# Altium schematic sheet bunny_brain_D.SchDoc
size D; Organization: Altium Limited; Address1: 3 Minna Close; Address2: Belrose; Address3: NSW 2085; Address4: Australia; SheetNumber: 3; SheetTotal: 3; PAGE_TITLE: -
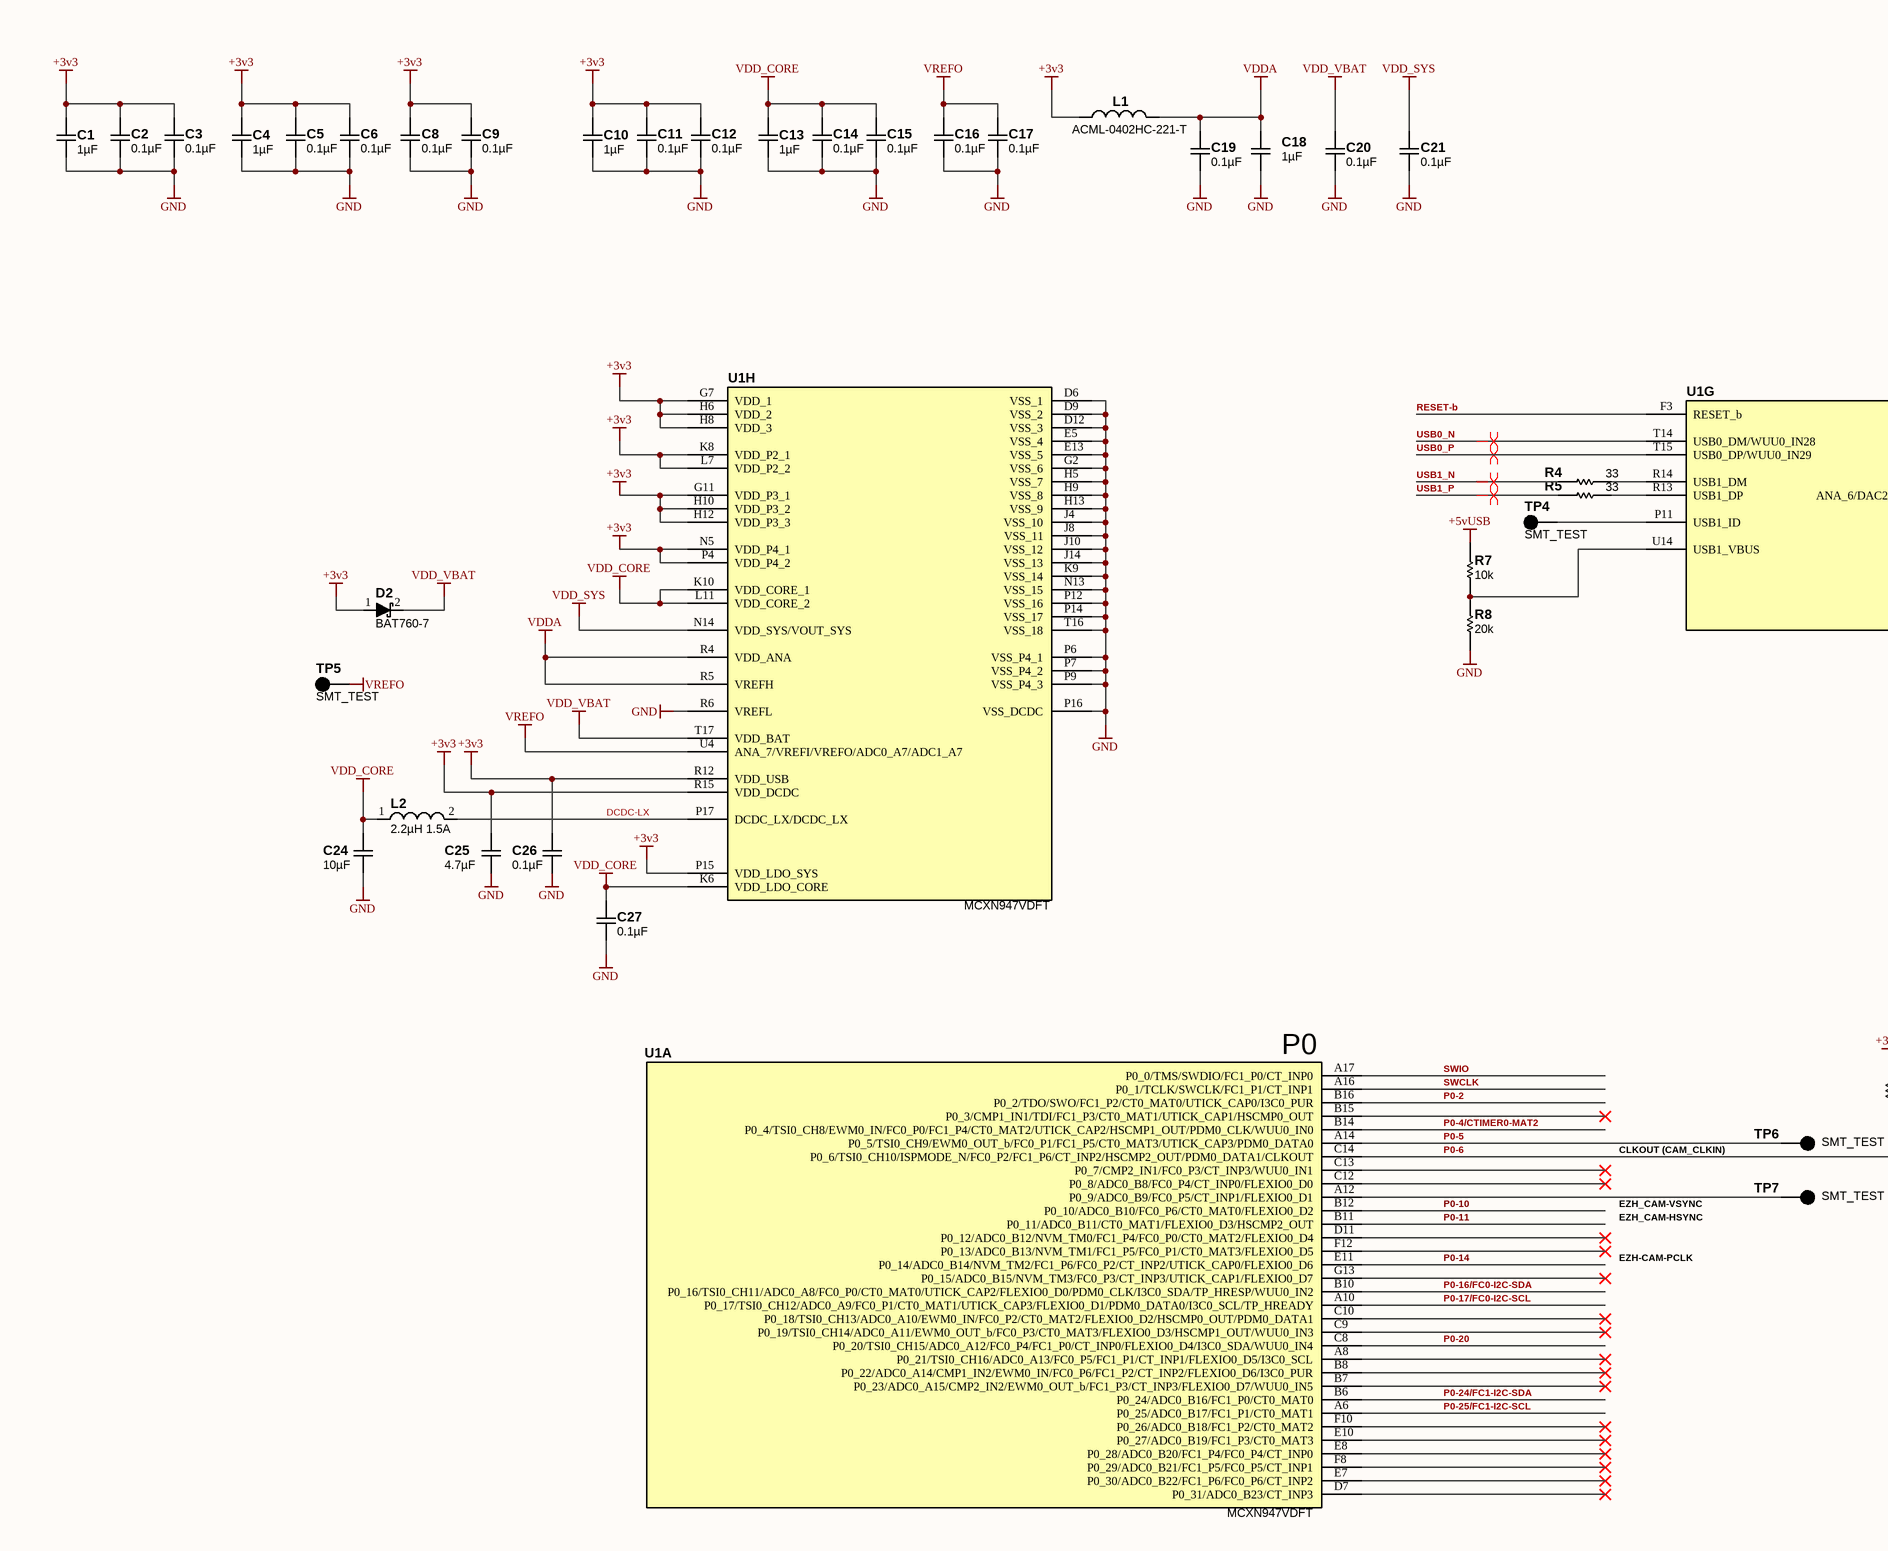
[diagram p0: bunny_brain_D.SchDoc, top left]
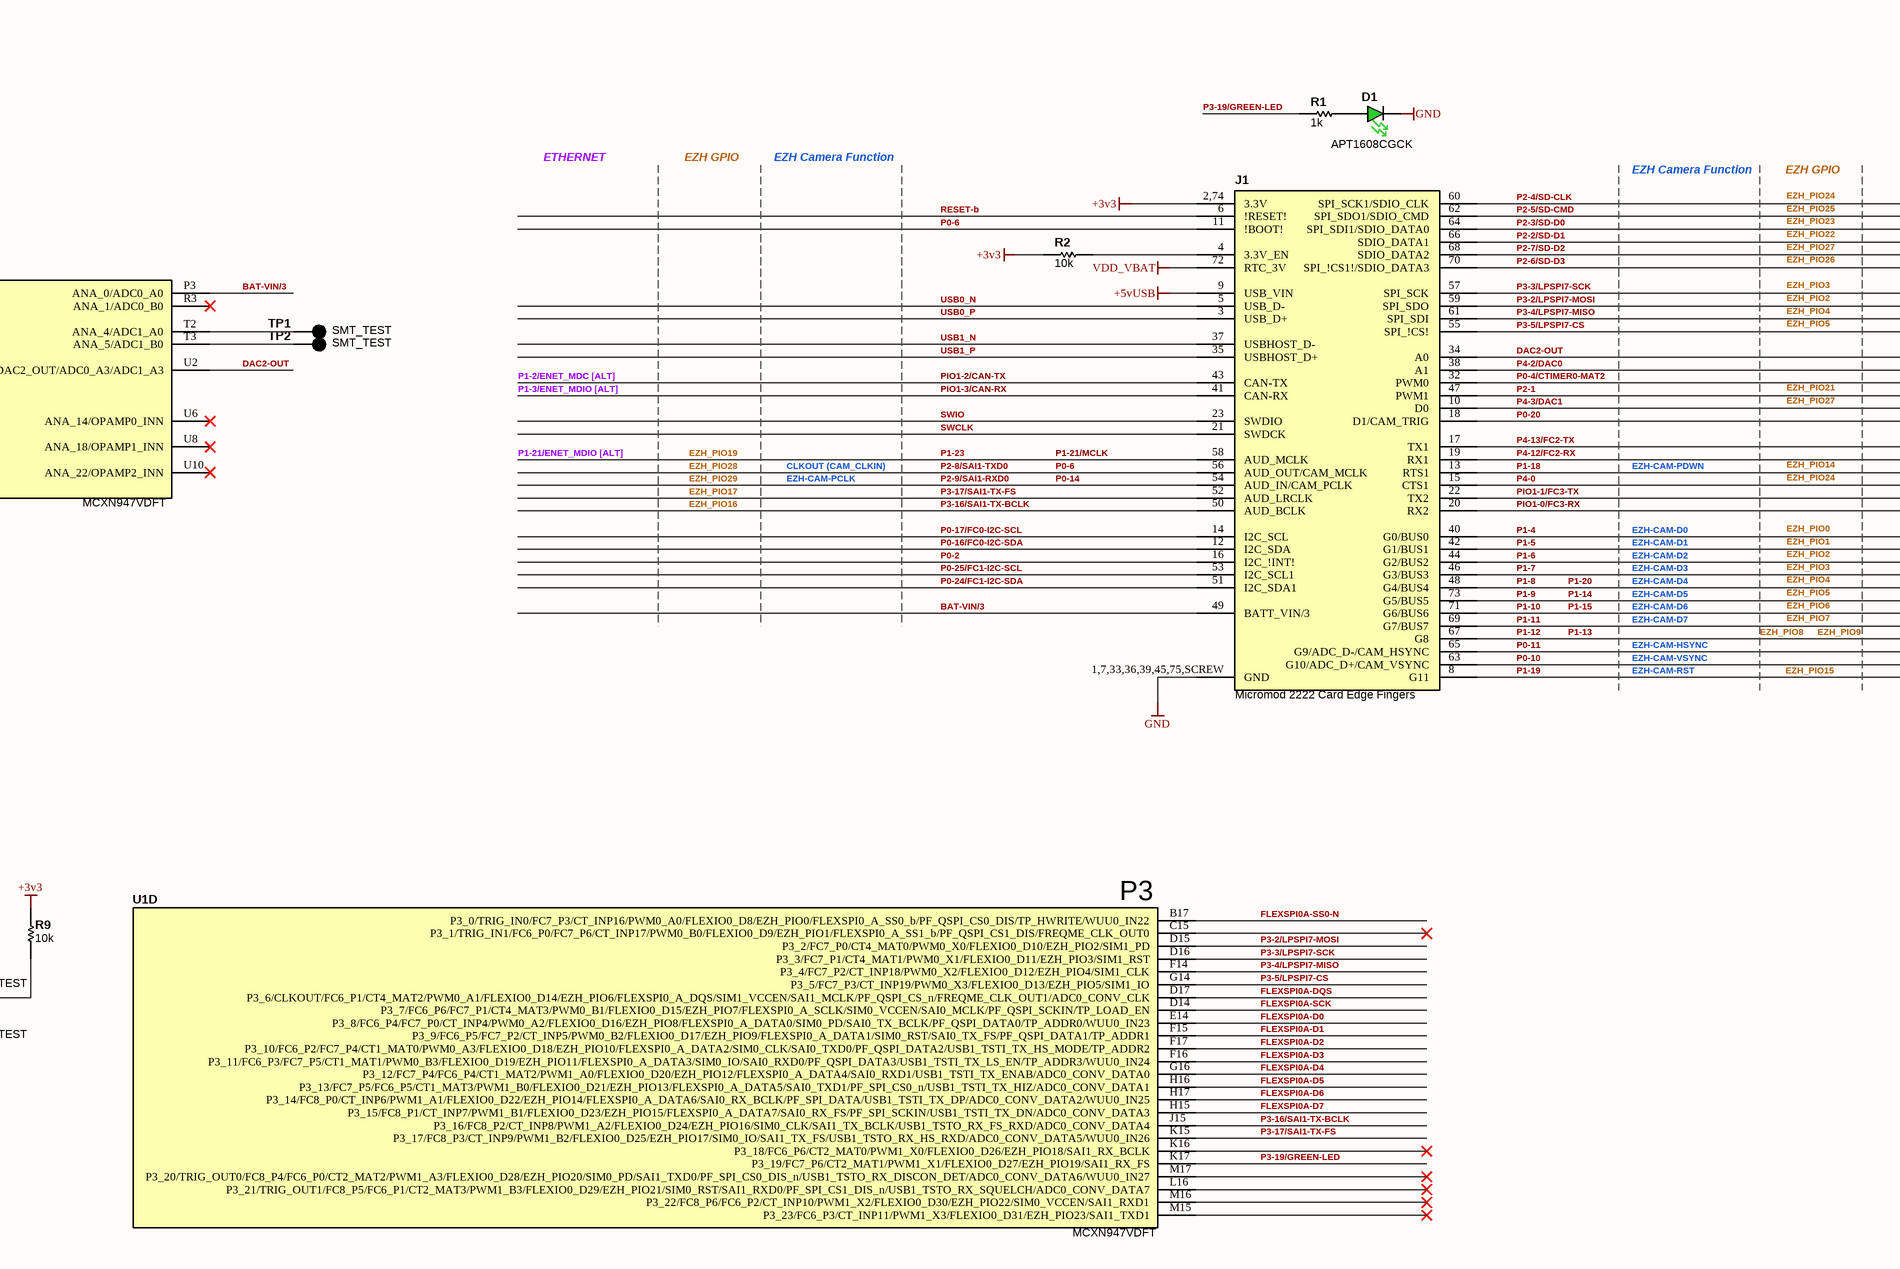
[diagram p1: bunny_brain_D.SchDoc, top middle]
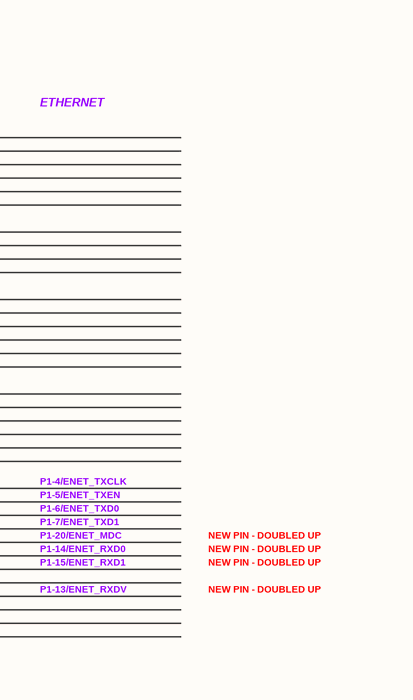
[diagram p2: bunny_brain_D.SchDoc, top right]
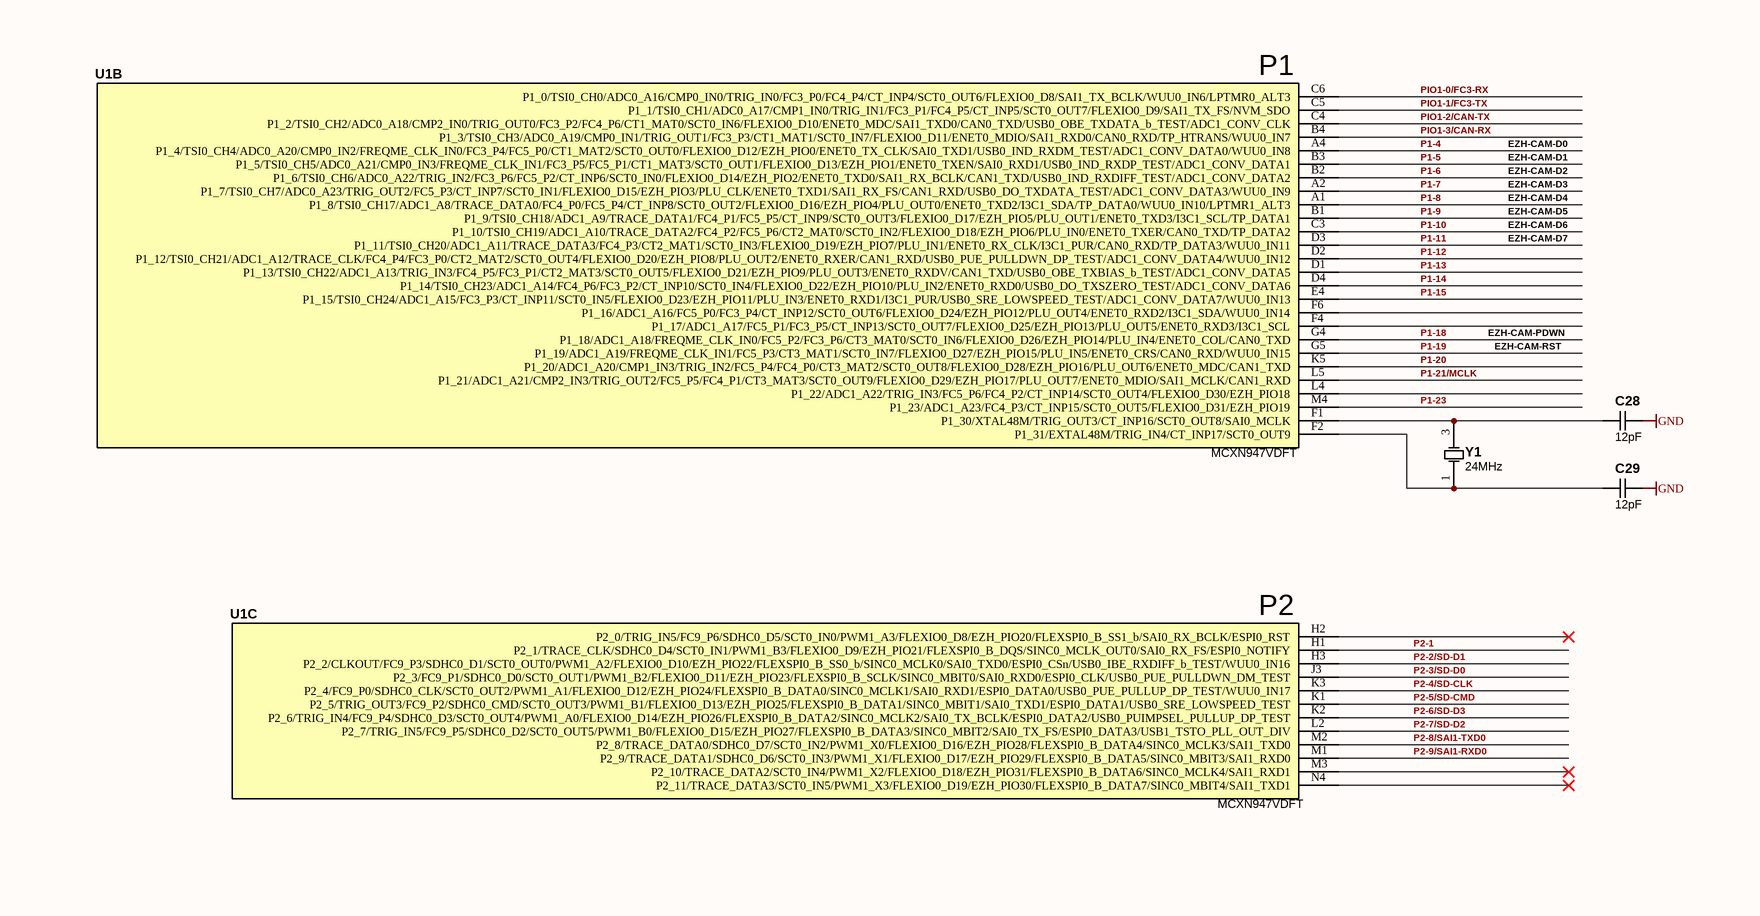
[diagram p3: bunny_brain_D.SchDoc, bottom left]
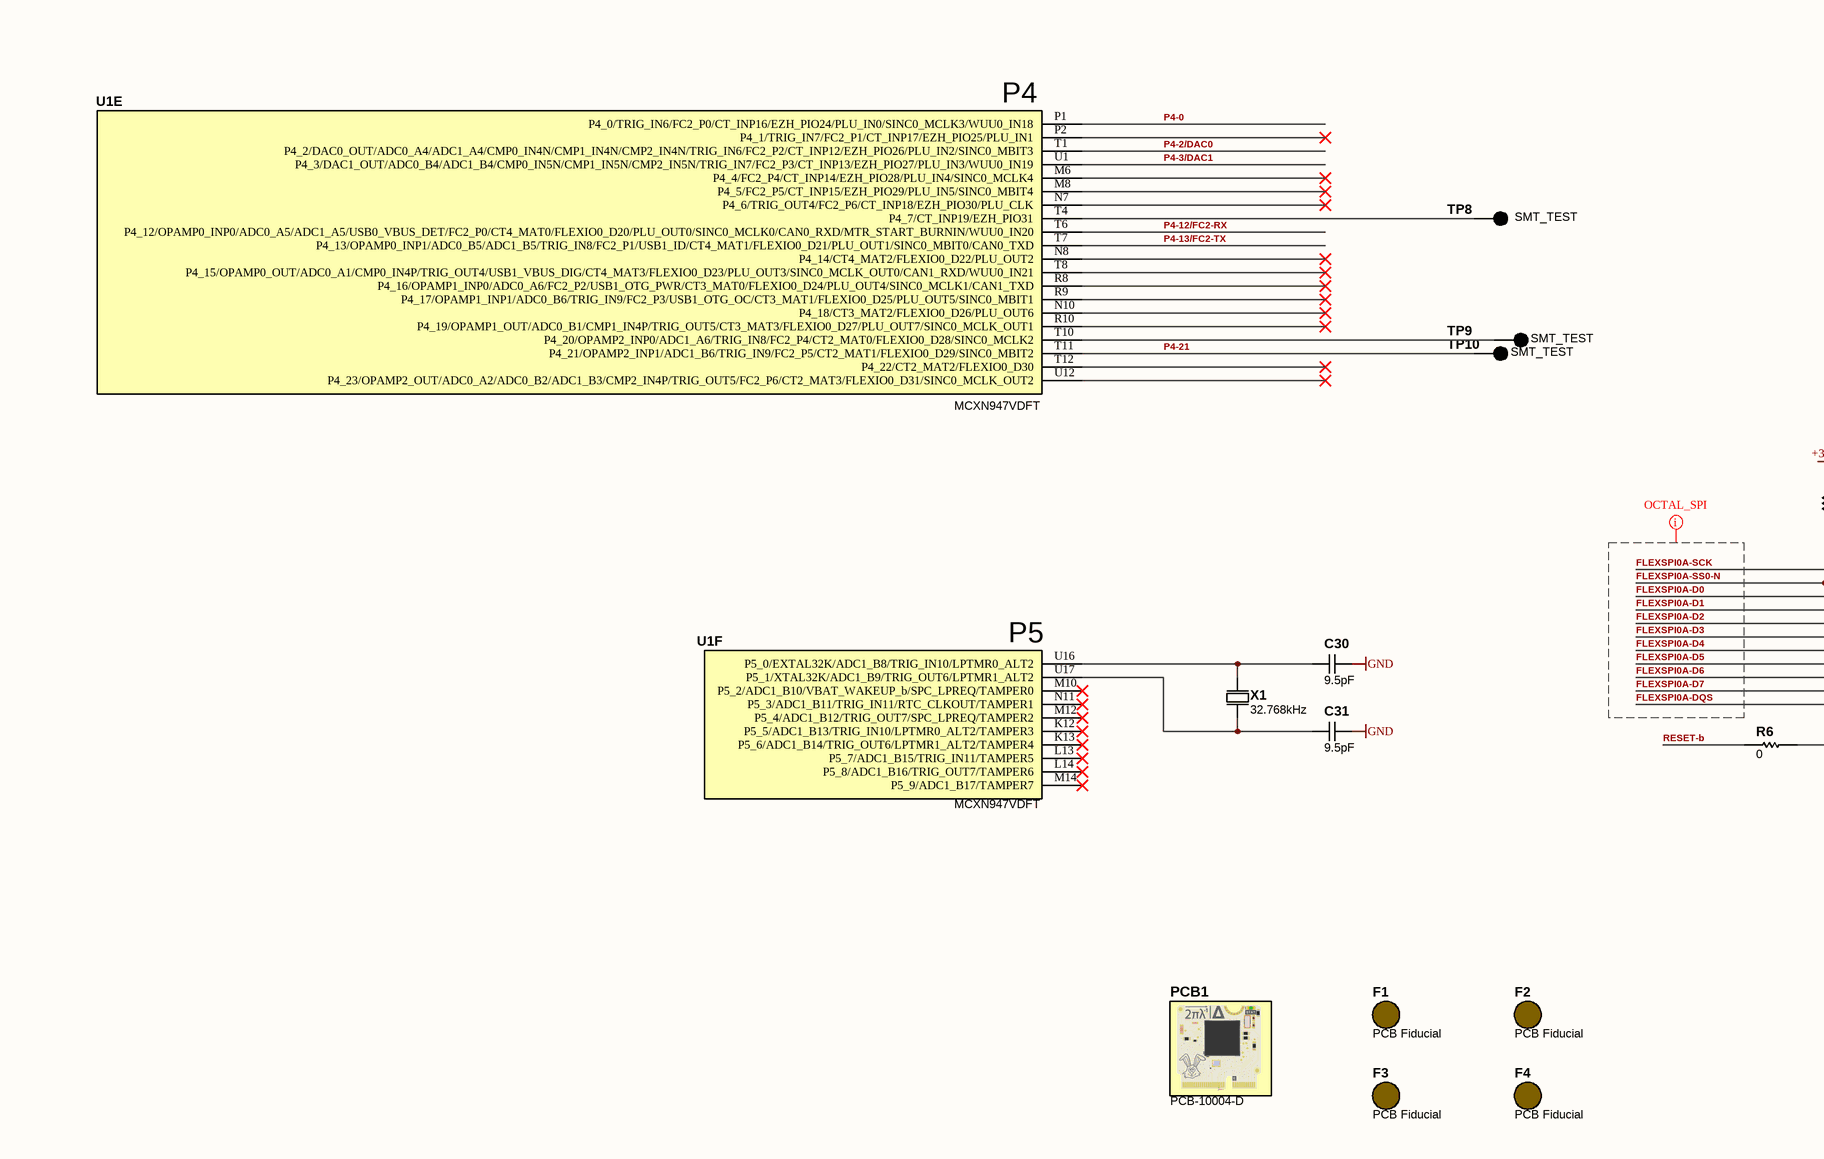
[diagram p4: bunny_brain_D.SchDoc, bottom middle]
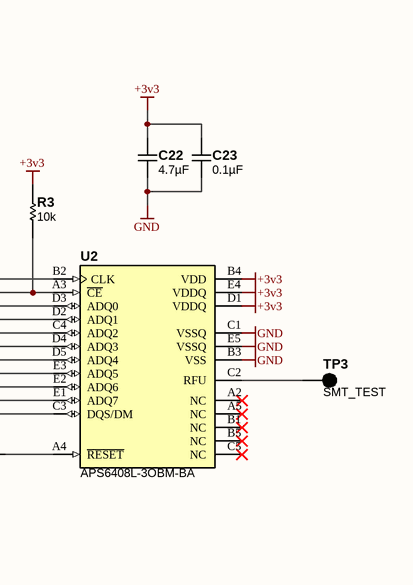
[diagram p5: bunny_brain_D.SchDoc, bottom right]

## Parts
C1  1µF  [C0402_0.55MM_HD]
C2  0.1µF  [C0402_0.55MM_HD]
C3  0.1µF  [C0402_0.55MM_HD]
C4  1µF  [C0402_0.55MM_HD]
C5  0.1µF  [C0402_0.55MM_HD]
C6  0.1µF  [C0402_0.55MM_HD]
C8  0.1µF  [C0402_0.55MM_HD]
C9  0.1µF  [C0402_0.55MM_HD]
C10  1µF  [C0402_0.55MM_HD]
C11  0.1µF  [C0402_0.55MM_HD]
C12  0.1µF  [C0402_0.55MM_HD]
C13  1µF  [C0402_0.55MM_HD]
C14  0.1µF  [C0402_0.55MM_HD]
C15  0.1µF  [C0402_0.55MM_HD]
C16  0.1µF  [C0402_0.55MM_HD]
C17  0.1µF  [C0402_0.55MM_HD]
C18  1µF  [C0402_0.55MM_HD]
C19  0.1µF  [C0402_0.55MM_HD]
C20  0.1µF  [C0402_0.55MM_HD]
C21  0.1µF  [C0402_0.55MM_HD]
C22  4.7µF  [C0603_1.00MM_MD]
C23  0.1µF  [C0402_0.55MM_HD]
C24  10µF  [C0603_0.90MM_MD]
C25  4.7µF  [C0603_1.00MM_MD]
C26  0.1µF  [C0402_0.55MM_HD]
C27  0.1µF  [C0402_0.55MM_HD]
C28  12pF  [C0402_0.55MM_MD]
C29  12pF  [C0402_0.55MM_MD]
C30  9.5pF  [PERFECT_0402]
C31  9.5pF  [PERFECT_0402]
D1  APT1608CGCK  [LED_0603 - GREEN]
D2  BAT760-7  [D_SOD-323_P]
F1  PCB Fiducial  [Fiducial 1mm - 2mm]  (no BOM)
F2  PCB Fiducial  [Fiducial 1mm - 2mm]  (no BOM)
F3  PCB Fiducial  [Fiducial 1mm - 2mm]  (no BOM)
F4  PCB Fiducial  [Fiducial 1mm - 2mm]  (no BOM)
J1  Micromod 2222 Card Edge Fingers  [MICROMOD-CARD--M2--2222]  (no BOM)
L1  ACML-0402HC-221-T  [C0402_HD]
L2  2.2µH 1.5A  [L_NRH3012]
PCB1  PCB-10004-D  (mechanical)
R1  1k  [R0603_0.55MM_HD]
R2  10k  [R0603_0.55MM_MD]
R3  10k  [R0603_0.55MM_HD]
R4  33  [R0603_0.55MM_HD]
R5  33  [R0603_0.55MM_HD]
R6  0  [R0402_0.40MM_HD]
R7  10k  [R0603_0.55MM_HD]
R8  20k  [R0603_0.55MM_HD]
R9  10k  [R0603_0.55MM_HD]
TP1  SMT_TEST  [SMT_TP - 20]  (no BOM)
TP2  SMT_TEST  [SMT_TP - 20]  (no BOM)
TP3  SMT_TEST  [SMT_TP - 20]  (no BOM)
TP4  SMT_TEST  [SMT_TP - 20]  (no BOM)
TP5  SMT_TEST  [SMT_TP - 20]  (no BOM)
TP6  SMT_TEST  [SMT_TP - 20]  (no BOM)
TP7  SMT_TEST  [SMT_TP - 20]  (no BOM)
TP8  SMT_TEST  [SMT_TP - 20]  (no BOM)
TP9  SMT_TEST  [SMT_TP - 20]  (no BOM)
TP10  SMT_TEST  [SMT_TP - 20]  (no BOM)
U1  MCXN947VDFT  [VFBGA184]  (parts A,B,C,D,E,F,G,H of 8)
U2  APS6408L-3OBM-BA  [BGA24C100P5X5_600X800X120]
X1  32.768kHz  [XTAL_3215]
Y1  24MHz  [ECS-1637B]

## Nets
+3v3: C1.1 C2.2 C3.2 C4.1 C5.2 C6.2 C8.2 C9.2 C10.1 C11.2 C12.2 C22.1 C23.1 C25.1 C26.2 D2.1(A) J1.2,74(3.3V) L1.1 R2.2 R3.2 R9.2 U1.G7(VDD_1) U1.G11(VDD_P3_1) U1.H6(VDD_2) U1.H8(VDD_3) U1.H10(VDD_P3_2) U1.H12(VDD_P3_3) U1.K8(VDD_P2_1) U1.L7(VDD_P2_2) U1.N5(VDD_P4_1) U1.P4(VDD_P4_2) U1.P15(VDD_LDO_SYS) U1.R12(VDD_USB) U1.R15(VDD_DCDC) U2.B4(VDD) U2.D1(VDDQ) U2.E4(VDDQ)
+5vUSB: J1.9(USB_VIN) R7.2
GND: C1.2 C2.1 C3.1 C4.2 C5.1 C6.1 C8.1 C9.1 C10.2 C11.1 C12.1 C13.2 C14.1 C15.1 C16.1 C17.1 C18.2 C19.1 C20.1 C21.1 C22.2 C23.2 C24.1 C25.2 C26.1 C27.1 C28.2 C29.2 C30.2 C31.2 D1.C J1.1,7,33,36,39,45,75,SCREW(GND) R8.1 U1.D6(VSS_1) U1.D9(VSS_2) U1.D12(VSS_3) U1.E5(VSS_4) U1.E13(VSS_5) U1.G2(VSS_6) U1.H5(VSS_7) U1.H9(VSS_8) U1.H13(VSS_9) U1.J4(VSS_10) U1.J8(VSS_11) U1.J10(VSS_12) U1.J14(VSS_13) U1.K9(VSS_14) U1.N13(VSS_15) U1.P6(VSS_P4_1) U1.P7(VSS_P4_2) U1.P9(VSS_P4_3) U1.P12(VSS_16) U1.P14(VSS_17) U1.P16(VSS_DCDC) U1.R6(VREFL) U1.T16(VSS_18) U2.B3(VSS) U2.C1(VSSQ) U2.E5(VSSQ)
VDD_CORE: C13.1 C14.2 C15.2 C24.2 C27.2 L2.1 U1.K6(VDD_LDO_CORE) U1.K10(VDD_CORE_1) U1.L11(VDD_CORE_2)
VDD_SYS: C21.2 U1.N14(VDD_SYS/VOUT_SYS)
VDD_VBAT: C20.2 D2.2(K) J1.72(RTC_3V) U1.T17(VDD_BAT)
VDDA: C18.1 C19.2 L1.2 U1.R4(VDD_ANA) U1.R5(VREFH)
VREFO: C16.2 C17.2 TP5.1 U1.U4(ANA_7/VREFI/VREFO/ADC0_A7/ADC1_A7)
BAT-VIN/3: J1.49(BATT_VIN/3) U1.P3(ANA_0/ADC0_A0)
DAC2-OUT: J1.34(A0) U1.U2(ANA_6/DAC2_OUT/ADC0_A3/ADC1_A3)
DCDC-LX: L2.2 U1.P17(DCDC_LX/DCDC_LX)
FLEXSPI0A-D0: U1.E14(P3_8/FC6_P4/FC7_P0/CT_INP4/PWM0_A2/FLEXIO0_D16/EZH_PIO8/FLEXSPI0_A_DATA0/SIM0_PD/SAI0_TX_BCLK/PF_QSPI_DATA0/TP_ADDR0/WUU0_IN23) U2.D3(ADQ0)
FLEXSPI0A-D1: U1.F15(P3_9/FC6_P5/FC7_P2/CT_INP5/PWM0_B2/FLEXIO0_D17/EZH_PIO9/FLEXSPI0_A_DATA1/SIM0_RST/SAI0_TX_FS/PF_QSPI_DATA1/TP_ADDR1) U2.D2(ADQ1)
FLEXSPI0A-D2: U1.F17(P3_10/FC6_P2/FC7_P4/CT1_MAT0/PWM0_A3/FLEXIO0_D18/EZH_PIO10/FLEXSPI0_A_DATA2/SIM0_CLK/SAI0_TXD0/PF_QSPI_DATA2/USB1_TSTI_TX_HS_MODE/TP_ADDR2) U2.C4(ADQ2)
FLEXSPI0A-D3: U1.F16(P3_11/FC6_P3/FC7_P5/CT1_MAT1/PWM0_B3/FLEXIO0_D19/EZH_PIO11/FLEXSPI0_A_DATA3/SIM0_IO/SAI0_RXD0/PF_QSPI_DATA3/USB1_TSTI_TX_LS_EN/TP_ADDR3/WUU0_IN24) U2.D4(ADQ3)
FLEXSPI0A-D4: U1.G16(P3_12/FC7_P4/FC6_P4/CT1_MAT2/PWM1_A0/FLEXIO0_D20/EZH_PIO12/FLEXSPI0_A_DATA4/SAI0_RXD1/USB1_TSTI_TX_ENAB/ADC0_CONV_DATA0) U2.D5(ADQ4)
FLEXSPI0A-D5: U1.H16(P3_13/FC7_P5/FC6_P5/CT1_MAT3/PWM1_B0/FLEXIO0_D21/EZH_PIO13/FLEXSPI0_A_DATA5/SAI0_TXD1/PF_SPI_CS0_n/USB1_TSTI_TX_HIZ/ADC0_CONV_DATA1) U2.E3(ADQ5)
FLEXSPI0A-D6: U1.H17(P3_14/FC8_P0/CT_INP6/PWM1_A1/FLEXIO0_D22/EZH_PIO14/FLEXSPI0_A_DATA6/SAI0_RX_BCLK/PF_SPI_DATA/USB1_TSTI_TX_DP/ADC0_CONV_DATA2/WUU0_IN25) U2.E2(ADQ6)
FLEXSPI0A-D7: U1.H15(P3_15/FC8_P1/CT_INP7/PWM1_B1/FLEXIO0_D23/EZH_PIO15/FLEXSPI0_A_DATA7/SAI0_RX_FS/PF_SPI_SCKIN/USB1_TSTI_TX_DN/ADC0_CONV_DATA3) U2.E1(ADQ7)
FLEXSPI0A-DQS: U1.D17(P3_6/CLKOUT/FC6_P1/CT4_MAT2/PWM0_A1/FLEXIO0_D14/EZH_PIO6/FLEXSPI0_A_DQS/SIM1_VCCEN/SAI1_MCLK/PF_QSPI_CS_n/FREQME_CLK_OUT1/ADC0_CONV_CLK) U2.C3(DQS/DM)
FLEXSPI0A-SCK: U1.D14(P3_7/FC6_P6/FC7_P1/CT4_MAT3/PWM0_B1/FLEXIO0_D15/EZH_PIO7/FLEXSPI0_A_SCLK/SIM0_VCCEN/SAI0_MCLK/PF_QSPI_SCKIN/TP_LOAD_EN) U2.B2(CLK)
FLEXSPI0A-SS0-N: R3.1 U1.B17(P3_0/TRIG_IN0/FC7_P3/CT_INP16/PWM0_A0/FLEXIO0_D8/EZH_PIO0/FLEXSPI0_A_SS0_b/PF_QSPI_CS0_DIS/TP_HWRITE/WUU0_IN22) U2.A3(~{CE})
P0-2: J1.16(I2C_!INT!) U1.B16(P0_2/TDO/SWO/FC1_P2/CT0_MAT0/UTICK_CAP0/I3C0_PUR)
P0-4/CTIMER0-MAT2: J1.32(PWM0) U1.B14(P0_4/TSI0_CH8/EWM0_IN/FC0_P0/FC1_P4/CT0_MAT2/UTICK_CAP2/HSCMP1_OUT/PDM0_CLK/WUU0_IN0)
P0-5: TP6.1 U1.A14(P0_5/TSI0_CH9/EWM0_OUT_b/FC0_P1/FC1_P5/CT0_MAT3/UTICK_CAP3/PDM0_DATA0)
P0-6: J1.11(!BOOT!) J1.56(AUD_OUT/CAM_MCLK) R9.1 U1.C14(P0_6/TSI0_CH10/ISPMODE_N/FC0_P2/FC1_P6/CT_INP2/HSCMP2_OUT/PDM0_DATA1/CLKOUT) U1.M2(P2_8/TRACE_DATA0/SDHC0_D7/SCT0_IN2/PWM1_X0/FLEXIO0_D16/EZH_PIO28/FLEXSPI0_B_DATA4/SINC0_MCLK3/SAI1_TXD0)  [also labelled P2-8/SAI1-TXD0]
P0-10: J1.63(G10/ADC_D+/CAM_VSYNC) U1.B12(P0_10/ADC0_B10/FC0_P6/CT0_MAT0/FLEXIO0_D2)
P0-11: J1.65(G9/ADC_D-/CAM_HSYNC) U1.B11(P0_11/ADC0_B11/CT0_MAT1/FLEXIO0_D3/HSCMP2_OUT)
P0-14: J1.54(AUD_IN/CAM_PCLK) U1.E11(P0_14/ADC0_B14/NVM_TM2/FC1_P6/FC0_P2/CT_INP2/UTICK_CAP0/FLEXIO0_D6) U1.M1(P2_9/TRACE_DATA1/SDHC0_D6/SCT0_IN3/PWM1_X1/FLEXIO0_D17/EZH_PIO29/FLEXSPI0_B_DATA5/SINC0_MBIT3/SAI1_RXD0)  [also labelled P2-9/SAI1-RXD0]
P0-16/FC0-I2C-SDA: J1.12(I2C_SDA) U1.B10(P0_16/TSI0_CH11/ADC0_A8/FC0_P0/CT0_MAT0/UTICK_CAP2/FLEXIO0_D0/PDM0_CLK/I3C0_SDA/TP_HRESP/WUU0_IN2)
P0-17/FC0-I2C-SCL: J1.14(I2C_SCL) U1.A10(P0_17/TSI0_CH12/ADC0_A9/FC0_P1/CT0_MAT1/UTICK_CAP3/FLEXIO0_D1/PDM0_DATA0/I3C0_SCL/TP_HREADY)
P0-20: J1.18(D1/CAM_TRIG) U1.C8(P0_20/TSI0_CH15/ADC0_A12/FC0_P4/FC1_P0/CT_INP0/FLEXIO0_D4/I3C0_SDA/WUU0_IN4)
P0-24/FC1-I2C-SDA: J1.51(I2C_SDA1) U1.B6(P0_24/ADC0_B16/FC1_P0/CT0_MAT0)
P0-25/FC1-I2C-SCL: J1.53(I2C_SCL1) U1.A6(P0_25/ADC0_B17/FC1_P1/CT0_MAT1)
P1-4: J1.40(G0/BUS0) U1.A4(P1_4/TSI0_CH4/ADC0_A20/CMP0_IN2/FREQME_CLK_IN0/FC3_P4/FC5_P0/CT1_MAT2/SCT0_OUT0/FLEXIO0_D12/EZH_PIO0/ENET0_TX_CLK/SAI0_TXD1/USB0_IND_RXDM_TEST/ADC1_CONV_DATA0/WUU0_IN8)
P1-5: J1.42(G1/BUS1) U1.B3(P1_5/TSI0_CH5/ADC0_A21/CMP0_IN3/FREQME_CLK_IN1/FC3_P5/FC5_P1/CT1_MAT3/SCT0_OUT1/FLEXIO0_D13/EZH_PIO1/ENET0_TXEN/SAI0_RXD1/USB0_IND_RXDP_TEST/ADC1_CONV_DATA1)
P1-6: J1.44(G2/BUS2) U1.B2(P1_6/TSI0_CH6/ADC0_A22/TRIG_IN2/FC3_P6/FC5_P2/CT_INP6/SCT0_IN0/FLEXIO0_D14/EZH_PIO2/ENET0_TXD0/SAI1_RX_BCLK/CAN1_TXD/USB0_IND_RXDIFF_TEST/ADC1_CONV_DATA2)
P1-7: J1.46(G3/BUS3) U1.A2(P1_7/TSI0_CH7/ADC0_A23/TRIG_OUT2/FC5_P3/CT_INP7/SCT0_IN1/FLEXIO0_D15/EZH_PIO3/PLU_CLK/ENET0_TXD1/SAI1_RX_FS/CAN1_RXD/USB0_DO_TXDATA_TEST/ADC1_CONV_DATA3/WUU0_IN9)
P1-10: J1.71(G6/BUS6) U1.C3(P1_10/TSI0_CH19/ADC1_A10/TRACE_DATA2/FC4_P2/FC5_P6/CT2_MAT0/SCT0_IN2/FLEXIO0_D18/EZH_PIO6/PLU_IN0/ENET0_TXER/CAN0_TXD/TP_DATA2) U1.E4(P1_15/TSI0_CH24/ADC1_A15/FC3_P3/CT_INP11/SCT0_IN5/FLEXIO0_D23/EZH_PIO11/PLU_IN3/ENET0_RXD1/I3C1_PUR/USB0_SRE_LOWSPEED_TEST/ADC1_CONV_DATA7/WUU0_IN13)  [also labelled P1-15]
P1-11: J1.69(G7/BUS7) U1.D3(P1_11/TSI0_CH20/ADC1_A11/TRACE_DATA3/FC4_P3/CT2_MAT1/SCT0_IN3/FLEXIO0_D19/EZH_PIO7/PLU_IN1/ENET0_RX_CLK/I3C1_PUR/CAN0_RXD/TP_DATA3/WUU0_IN11)
P1-12: J1.67(G8) U1.D1(P1_13/TSI0_CH22/ADC1_A13/TRIG_IN3/FC4_P5/FC3_P1/CT2_MAT3/SCT0_OUT5/FLEXIO0_D21/EZH_PIO9/PLU_OUT3/ENET0_RXDV/CAN1_TXD/USB0_OBE_TXBIAS_b_TEST/ADC1_CONV_DATA5) U1.D2(P1_12/TSI0_CH21/ADC1_A12/TRACE_CLK/FC4_P4/FC3_P0/CT2_MAT2/SCT0_OUT4/FLEXIO0_D20/EZH_PIO8/PLU_OUT2/ENET0_RXER/CAN1_RXD/USB0_PUE_PULLDWN_DP_TEST/ADC1_CONV_DATA4/WUU0_IN12)  [also labelled P1-13]
P1-14: J1.73(G5/BUS5) U1.B1(P1_9/TSI0_CH18/ADC1_A9/TRACE_DATA1/FC4_P1/FC5_P5/CT_INP9/SCT0_OUT3/FLEXIO0_D17/EZH_PIO5/PLU_OUT1/ENET0_TXD3/I3C1_SCL/TP_DATA1) U1.D4(P1_14/TSI0_CH23/ADC1_A14/FC4_P6/FC3_P2/CT_INP10/SCT0_IN4/FLEXIO0_D22/EZH_PIO10/PLU_IN2/ENET0_RXD0/USB0_DO_TXSZERO_TEST/ADC1_CONV_DATA6)  [also labelled P1-9]
P1-18: J1.13(RTS1) U1.G4(P1_18/ADC1_A18/FREQME_CLK_IN0/FC5_P2/FC3_P6/CT3_MAT0/SCT0_IN6/FLEXIO0_D26/EZH_PIO14/PLU_IN4/ENET0_COL/CAN0_TXD)
P1-19: J1.8(G11) U1.G5(P1_19/ADC1_A19/FREQME_CLK_IN1/FC5_P3/CT3_MAT1/SCT0_IN7/FLEXIO0_D27/EZH_PIO15/PLU_IN5/ENET0_CRS/CAN0_RXD/WUU0_IN15)
P1-20: J1.48(G4/BUS4) U1.A1(P1_8/TSI0_CH17/ADC1_A8/TRACE_DATA0/FC4_P0/FC5_P4/CT_INP8/SCT0_OUT2/FLEXIO0_D16/EZH_PIO4/PLU_OUT0/ENET0_TXD2/I3C1_SDA/TP_DATA0/WUU0_IN10/LPTMR1_ALT3) U1.K5(P1_20/ADC1_A20/CMP1_IN3/TRIG_IN2/FC5_P4/FC4_P0/CT3_MAT2/SCT0_OUT8/FLEXIO0_D28/EZH_PIO16/PLU_OUT6/ENET0_MDC/CAN1_TXD)  [also labelled P1-8]
P1-21/MCLK: J1.58(AUD_MCLK) U1.L5(P1_21/ADC1_A21/CMP2_IN3/TRIG_OUT2/FC5_P5/FC4_P1/CT3_MAT3/SCT0_OUT9/FLEXIO0_D29/EZH_PIO17/PLU_OUT7/ENET0_MDIO/SAI1_MCLK/CAN1_RXD) U1.M4(P1_23/ADC1_A23/FC4_P3/CT_INP15/SCT0_OUT5/FLEXIO0_D31/EZH_PIO19)  [also labelled P1-23]
P2-1: J1.47(PWM1) U1.H1(P2_1/TRACE_CLK/SDHC0_D4/SCT0_IN1/PWM1_B3/FLEXIO0_D9/EZH_PIO21/FLEXSPI0_B_DQS/SINC0_MCLK_OUT0/SAI0_RX_FS/ESPI0_NOTIFY)
P2-2/SD-D1: J1.66(SDIO_DATA1) U1.H3(P2_2/CLKOUT/FC9_P3/SDHC0_D1/SCT0_OUT0/PWM1_A2/FLEXIO0_D10/EZH_PIO22/FLEXSPI0_B_SS0_b/SINC0_MCLK0/SAI0_TXD0/ESPI0_CSn/USB0_IBE_RXDIFF_b_TEST/WUU0_IN16)
P2-3/SD-D0: J1.64(SPI_SDI1/SDIO_DATA0) U1.J3(P2_3/FC9_P1/SDHC0_D0/SCT0_OUT1/PWM1_B2/FLEXIO0_D11/EZH_PIO23/FLEXSPI0_B_SCLK/SINC0_MBIT0/SAI0_RXD0/ESPI0_CLK/USB0_PUE_PULLDWN_DM_TEST)
P2-4/SD-CLK: J1.60(SPI_SCK1/SDIO_CLK) U1.K3(P2_4/FC9_P0/SDHC0_CLK/SCT0_OUT2/PWM1_A1/FLEXIO0_D12/EZH_PIO24/FLEXSPI0_B_DATA0/SINC0_MCLK1/SAI0_RXD1/ESPI0_DATA0/USB0_PUE_PULLUP_DP_TEST/WUU0_IN17)
P2-5/SD-CMD: J1.62(SPI_SDO1/SDIO_CMD) U1.K1(P2_5/TRIG_OUT3/FC9_P2/SDHC0_CMD/SCT0_OUT3/PWM1_B1/FLEXIO0_D13/EZH_PIO25/FLEXSPI0_B_DATA1/SINC0_MBIT1/SAI0_TXD1/ESPI0_DATA1/USB0_SRE_LOWSPEED_TEST)
P2-6/SD-D3: J1.70(SPI_!CS1!/SDIO_DATA3) U1.K2(P2_6/TRIG_IN4/FC9_P4/SDHC0_D3/SCT0_OUT4/PWM1_A0/FLEXIO0_D14/EZH_PIO26/FLEXSPI0_B_DATA2/SINC0_MCLK2/SAI0_TX_BCLK/ESPI0_DATA2/USB0_PUIMPSEL_PULLUP_DP_TEST)
P2-7/SD-D2: J1.68(SDIO_DATA2) U1.L2(P2_7/TRIG_IN5/FC9_P5/SDHC0_D2/SCT0_OUT5/PWM1_B0/FLEXIO0_D15/EZH_PIO27/FLEXSPI0_B_DATA3/SINC0_MBIT2/SAI0_TX_FS/ESPI0_DATA3/USB1_TSTO_PLL_OUT_DIV)
P3-2/LPSPI7-MOSI: J1.59(SPI_SDO) U1.D15(P3_2/FC7_P0/CT4_MAT0/PWM0_X0/FLEXIO0_D10/EZH_PIO2/SIM1_PD)
P3-3/LPSPI7-SCK: J1.57(SPI_SCK) U1.D16(P3_3/FC7_P1/CT4_MAT1/PWM0_X1/FLEXIO0_D11/EZH_PIO3/SIM1_RST)
P3-4/LPSPI7-MISO: J1.61(SPI_SDI) U1.F14(P3_4/FC7_P2/CT_INP18/PWM0_X2/FLEXIO0_D12/EZH_PIO4/SIM1_CLK)
P3-5/LPSPI7-CS: J1.55(SPI_!CS!) U1.G14(P3_5/FC7_P3/CT_INP19/PWM0_X3/FLEXIO0_D13/EZH_PIO5/SIM1_IO)
P3-16/SAI1-TX-BCLK: J1.50(AUD_BCLK) U1.J15(P3_16/FC8_P2/CT_INP8/PWM1_A2/FLEXIO0_D24/EZH_PIO16/SIM0_CLK/SAI1_TX_BCLK/USB1_TSTO_RX_FS_RXD/ADC0_CONV_DATA4)
P3-17/SAI1-TX-FS: J1.52(AUD_LRCLK) U1.K15(P3_17/FC8_P3/CT_INP9/PWM1_B2/FLEXIO0_D25/EZH_PIO17/SIM0_IO/SAI1_TX_FS/USB1_TSTO_RX_HS_RXD/ADC0_CONV_DATA5/WUU0_IN26)
P3-19/GREEN-LED: R1.2 U1.K17(P3_19/FC7_P6/CT2_MAT1/PWM1_X1/FLEXIO0_D27/EZH_PIO19/SAI1_RX_FS)
P4-0: J1.15(CTS1) U1.P1(P4_0/TRIG_IN6/FC2_P0/CT_INP16/EZH_PIO24/PLU_IN0/SINC0_MCLK3/WUU0_IN18)
P4-2/DAC0: J1.38(A1) U1.T1(P4_2/DAC0_OUT/ADC0_A4/ADC1_A4/CMP0_IN4N/CMP1_IN4N/CMP2_IN4N/TRIG_IN6/FC2_P2/CT_INP12/EZH_PIO26/PLU_IN2/SINC0_MBIT3)
P4-3/DAC1: J1.10(D0) U1.U1(P4_3/DAC1_OUT/ADC0_B4/ADC1_B4/CMP0_IN5N/CMP1_IN5N/CMP2_IN5N/TRIG_IN7/FC2_P3/CT_INP13/EZH_PIO27/PLU_IN3/WUU0_IN19)
P4-12/FC2-RX: J1.19(RX1) U1.T6(P4_12/OPAMP0_INP0/ADC0_A5/ADC1_A5/USB0_VBUS_DET/FC2_P0/CT4_MAT0/FLEXIO0_D20/PLU_OUT0/SINC0_MCLK0/CAN0_RXD/MTR_START_BURNIN/WUU0_IN20)
P4-13/FC2-TX: J1.17(TX1) U1.T7(P4_13/OPAMP0_INP1/ADC0_B5/ADC1_B5/TRIG_IN8/FC2_P1/USB1_ID/CT4_MAT1/FLEXIO0_D21/PLU_OUT1/SINC0_MBIT0/CAN0_TXD)
P4-21: TP10.1 U1.T11(P4_21/OPAMP2_INP1/ADC1_B6/TRIG_IN9/FC2_P5/CT2_MAT1/FLEXIO0_D29/SINC0_MBIT2)
PIO1-0/FC3-RX: J1.20(RX2) U1.C6(P1_0/TSI0_CH0/ADC0_A16/CMP0_IN0/TRIG_IN0/FC3_P0/FC4_P4/CT_INP4/SCT0_OUT6/FLEXIO0_D8/SAI1_TX_BCLK/WUU0_IN6/LPTMR0_ALT3)
PIO1-1/FC3-TX: J1.22(TX2) U1.C5(P1_1/TSI0_CH1/ADC0_A17/CMP1_IN0/TRIG_IN1/FC3_P1/FC4_P5/CT_INP5/SCT0_OUT7/FLEXIO0_D9/SAI1_TX_FS/NVM_SDO)
PIO1-2/CAN-TX: J1.43(CAN-TX) U1.C4(P1_2/TSI0_CH2/ADC0_A18/CMP2_IN0/TRIG_OUT0/FC3_P2/FC4_P6/CT1_MAT0/SCT0_IN6/FLEXIO0_D10/ENET0_MDC/SAI1_TXD0/CAN0_TXD/USB0_OBE_TXDATA_b_TEST/ADC1_CONV_CLK)
PIO1-3/CAN-RX: J1.41(CAN-RX) U1.B4(P1_3/TSI0_CH3/ADC0_A19/CMP0_IN1/TRIG_OUT1/FC3_P3/CT1_MAT1/SCT0_IN7/FLEXIO0_D11/ENET0_MDIO/SAI1_RXD0/CAN0_RXD/TP_HTRANS/WUU0_IN7)
RESET-b: J1.6(!RESET!) R6.1 U1.F3(RESET_b)
SWCLK: J1.21(SWDCK) U1.A16(P0_1/TCLK/SWCLK/FC1_P1/CT_INP1)
SWIO: J1.23(SWDIO) U1.A17(P0_0/TMS/SWDIO/FC1_P0/CT_INP0)
USB0_N: J1.5(USB_D-) U1.T14(USB0_DM/WUU0_IN28)
USB0_P: J1.3(USB_D+) U1.T15(USB0_DP/WUU0_IN29)
USB1_N: J1.37(USBHOST_D-) R4.1
USB1_P: J1.35(USBHOST_D+) R5.1
NetC28_1: C28.1 U1.F1(P1_30/XTAL48M/TRIG_OUT3/CT_INP16/SCT0_OUT8/SAI0_MCLK) Y1.3
NetC29_1: C29.1 U1.F2(P1_31/EXTAL48M/TRIG_IN4/CT_INP17/SCT0_OUT9) Y1.1
NetC30_1: C30.1 U1.U16(P5_0/EXTAL32K/ADC1_B8/TRIG_IN10/LPTMR0_ALT2) X1.2(out)
NetC31_1: C31.1 U1.U17(P5_1/XTAL32K/ADC1_B9/TRIG_OUT6/LPTMR1_ALT2) X1.1(inp)
NetD1_A: D1.A R1.1
NetJ1_4: J1.4(3.3V_EN) R2.1
NetR4_2: R4.2 U1.R14(USB1_DM)
NetR5_2: R5.2 U1.R13(USB1_DP)
NetR6_2: R6.2 U2.A4(~{RESET})
NetR7_1: R7.1 R8.2 U1.U14(USB1_VBUS)
NetTP1_1: TP1.1 U1.T2(ANA_4/ADC1_A0)
NetTP2_1: TP2.1 U1.T3(ANA_5/ADC1_B0)
NetTP3_1: TP3.1 U2.C2(RFU)
NetTP4_1: TP4.1 U1.P11(USB1_ID)
NetTP7_1: TP7.1 U1.A12(P0_9/ADC0_B9/FC0_P5/CT_INP1/FLEXIO0_D1)
NetTP8_1: TP8.1 U1.T4(P4_7/CT_INP19/EZH_PIO31)
NetTP9_1: TP9.1 U1.T10(P4_20/OPAMP2_INP0/ADC1_A6/TRIG_IN8/FC2_P4/CT2_MAT0/FLEXIO0_D28/SINC0_MCLK2)

Not connected (* = marked no-connect by the designer): U1 A8(P0_21/TSI0_CH16/ADC0_A13/FC0_P5/FC1_P1/CT_INP1/FLEXIO0_D5/I3C0_SCL)* B7(P0_23/ADC0_A15/CMP2_IN2/EWM0_OUT_b/FC1_P3/CT_INP3/FLEXIO0_D7/WUU0_IN5)* B8(P0_22/ADC0_A14/CMP1_IN2/EWM0_IN/FC0_P6/FC1_P2/CT_INP2/FLEXIO0_D6/I3C0_PUR)* B15(P0_3/CMP1_IN1/TDI/FC1_P3/CT0_MAT1/UTICK_CAP1/HSCMP0_OUT)* C9(P0_19/TSI0_CH14/ADC0_A11/EWM0_OUT_b/FC0_P3/CT0_MAT3/FLEXIO0_D3/HSCMP1_OUT/WUU0_IN3)* C10(P0_18/TSI0_CH13/ADC0_A10/EWM0_IN/FC0_P2/CT0_MAT2/FLEXIO0_D2/HSCMP0_OUT/PDM0_DATA1)* C12(P0_8/ADC0_B8/FC0_P4/CT_INP0/FLEXIO0_D0)* C13(P0_7/CMP2_IN1/FC0_P3/CT_INP3/WUU0_IN1)* C15(P3_1/TRIG_IN1/FC6_P0/FC7_P6/CT_INP17/PWM0_B0/FLEXIO0_D9/EZH_PIO1/FLEXSPI0_A_SS1_b/PF_QSPI_CS1_DIS/FREQME_CLK_OUT0)* D7(P0_31/ADC0_B23/CT_INP3)* D11(P0_12/ADC0_B12/NVM_TM0/FC1_P4/FC0_P0/CT0_MAT2/FLEXIO0_D4)* E7(P0_30/ADC0_B22/FC1_P6/FC0_P6/CT_INP2)* E8(P0_28/ADC0_B20/FC1_P4/FC0_P4/CT_INP0)* E10(P0_27/ADC0_B19/FC1_P3/CT0_MAT3)* F4(P1_17/ADC1_A17/FC5_P1/FC3_P5/CT_INP13/SCT0_OUT7/FLEXIO0_D25/EZH_PIO13/PLU_OUT5/ENET0_RXD3/I3C1_SCL) F6(P1_16/ADC1_A16/FC5_P0/FC3_P4/CT_INP12/SCT0_OUT6/FLEXIO0_D24/EZH_PIO12/PLU_OUT4/ENET0_RXD2/I3C1_SDA/WUU0_IN14) F8(P0_29/ADC0_B21/FC1_P5/FC0_P5/CT_INP1)* F10(P0_26/ADC0_B18/FC1_P2/CT0_MAT2)* F12(P0_13/ADC0_B13/NVM_TM1/FC1_P5/FC0_P1/CT0_MAT3/FLEXIO0_D5)* G13(P0_15/ADC0_B15/NVM_TM3/FC0_P3/CT_INP3/UTICK_CAP1/FLEXIO0_D7)* H2(P2_0/TRIG_IN5/FC9_P6/SDHC0_D5/SCT0_IN0/PWM1_A3/FLEXIO0_D8/EZH_PIO20/FLEXSPI0_B_SS1_b/SAI0_RX_BCLK/ESPI0_RST)* K12(P5_5/ADC1_B13/TRIG_IN10/LPTMR0_ALT2/TAMPER3)* K13(P5_6/ADC1_B14/TRIG_OUT6/LPTMR1_ALT2/TAMPER4)* K16(P3_18/FC6_P6/CT2_MAT0/PWM1_X0/FLEXIO0_D26/EZH_PIO18/SAI1_RX_BCLK)* L4(P1_22/ADC1_A22/TRIG_IN3/FC5_P6/FC4_P2/CT_INP14/SCT0_OUT4/FLEXIO0_D30/EZH_PIO18) L13(P5_7/ADC1_B15/TRIG_IN11/TAMPER5)* L14(P5_8/ADC1_B16/TRIG_OUT7/TAMPER6)* L16(P3_21/TRIG_OUT1/FC8_P5/FC6_P1/CT2_MAT3/PWM1_B3/FLEXIO0_D29/EZH_PIO21/SIM0_RST/SAI1_RXD0/PF_SPI_CS1_DIS_n/USB1_TSTO_RX_SQUELCH/ADC0_CONV_DATA7)* M3(P2_10/TRACE_DATA2/SCT0_IN4/PWM1_X2/FLEXIO0_D18/EZH_PIO31/FLEXSPI0_B_DATA6/SINC0_MCLK4/SAI1_RXD1)* M6(P4_4/FC2_P4/CT_INP14/EZH_PIO28/PLU_IN4/SINC0_MCLK4)* M8(P4_5/FC2_P5/CT_INP15/EZH_PIO29/PLU_IN5/SINC0_MBIT4)* M10(P5_2/ADC1_B10/VBAT_WAKEUP_b/SPC_LPREQ/TAMPER0)* M12(P5_4/ADC1_B12/TRIG_OUT7/SPC_LPREQ/TAMPER2)* M14(P5_9/ADC1_B17/TAMPER7)* M15(P3_23/FC6_P3/CT_INP11/PWM1_X3/FLEXIO0_D31/EZH_PIO23/SAI1_TXD1)* M16(P3_22/FC8_P6/FC6_P2/CT_INP10/PWM1_X2/FLEXIO0_D30/EZH_PIO22/SIM0_VCCEN/SAI1_RXD1)* M17(P3_20/TRIG_OUT0/FC8_P4/FC6_P0/CT2_MAT2/PWM1_A3/FLEXIO0_D28/EZH_PIO20/SIM0_PD/SAI1_TXD0/PF_SPI_CS0_DIS_n/USB1_TSTO_RX_DISCON_DET/ADC0_CONV_DATA6/WUU0_IN27)* N4(P2_11/TRACE_DATA3/SCT0_IN5/PWM1_X3/FLEXIO0_D19/EZH_PIO30/FLEXSPI0_B_DATA7/SINC0_MBIT4/SAI1_TXD1)* N7(P4_6/TRIG_OUT4/FC2_P6/CT_INP18/EZH_PIO30/PLU_CLK)* N8(P4_14/CT4_MAT2/FLEXIO0_D22/PLU_OUT2)* N10(P4_18/CT3_MAT2/FLEXIO0_D26/PLU_OUT6)* N11(P5_3/ADC1_B11/TRIG_IN11/RTC_CLKOUT/TAMPER1)* P2(P4_1/TRIG_IN7/FC2_P1/CT_INP17/EZH_PIO25/PLU_IN1)* R3(ANA_1/ADC0_B0)* R8(P4_16/OPAMP1_INP0/ADC0_A6/FC2_P2/USB1_OTG_PWR/CT3_MAT0/FLEXIO0_D24/PLU_OUT4/SINC0_MCLK1/CAN1_TXD)* R9(P4_17/OPAMP1_INP1/ADC0_B6/TRIG_IN9/FC2_P3/USB1_OTG_OC/CT3_MAT1/FLEXIO0_D25/PLU_OUT5/SINC0_MBIT1)* R10(P4_19/OPAMP1_OUT/ADC0_B1/CMP1_IN4P/TRIG_OUT5/CT3_MAT3/FLEXIO0_D27/PLU_OUT7/SINC0_MCLK_OUT1)* T8(P4_15/OPAMP0_OUT/ADC0_A1/CMP0_IN4P/TRIG_OUT4/USB1_VBUS_DIG/CT4_MAT3/FLEXIO0_D23/PLU_OUT3/SINC0_MCLK_OUT0/CAN1_RXD/WUU0_IN21)* T12(P4_22/CT2_MAT2/FLEXIO0_D30)* U6(ANA_14/OPAMP0_INN)* U8(ANA_18/OPAMP1_INN)* U10(ANA_22/OPAMP2_INN)* U12(P4_23/OPAMP2_OUT/ADC0_A2/ADC0_B2/ADC1_B3/CMP2_IN4P/TRIG_OUT5/FC2_P6/CT2_MAT3/FLEXIO0_D31/SINC0_MCLK_OUT2)*; U2 A2(NC)* A5(NC)* B1(NC)* B5(NC)* C5(NC)*

## Layout directives
net class OCTAL_SPI: FLEXSPI0A-D0, FLEXSPI0A-D1, FLEXSPI0A-D2, FLEXSPI0A-D3, FLEXSPI0A-D4, FLEXSPI0A-D5, FLEXSPI0A-D6, FLEXSPI0A-D7, FLEXSPI0A-DQS, FLEXSPI0A-SCK, FLEXSPI0A-SS0-N
differential pair; differential pair class USB0: USB0_N, USB0_P
differential pair; differential pair class USB1: USB1_N, USB1_P

## Notes on the sheet
- ETHERNET
- EZH GPIO
- EZH Camera Function
- EZH_PIO24
- EZH_PIO25
- EZH_PIO23
- EZH_PIO22
- EZH_PIO27
- EZH_PIO26
- EZH_PIO3
- EZH_PIO2
- EZH_PIO4
- EZH_PIO5
- P1-3/ENET_MDIO [ALT]
- P1-2/ENET_MDC [ALT]
- EZH_PIO21
- P1-21/ENET_MDIO [ALT]
- EZH_PIO19
- EZH_PIO28
- EZH_PIO29
- EZH-CAM-PCLK
- CLKOUT (CAM_CLKIN)
- EZH-CAM-PDWN
- EZH_PIO14
- EZH_PIO17
- EZH_PIO16
- EZH-CAM-D0
- EZH-CAM-D1
- EZH_PIO0
- EZH_PIO1
- P1-5/ENET_TXEN
- P1-4/ENET_TXCLK
- EZH-CAM-D2
- EZH-CAM-D3
- EZH-CAM-D4
- EZH-CAM-D5
- EZH-CAM-D6
- EZH_PIO6
- P1-20/ENET_MDC
- P1-14/ENET_RXD0
- P1-7/ENET_TXD1
- P1-6/ENET_TXD0
- P1-15/ENET_RXD1
- NEW PIN - DOUBLED UP
- EZH-CAM-D7
- EZH-CAM-HSYNC
- EZH-CAM-VSYNC
- EZH-CAM-RST
- EZH_PIO8
- EZH_PIO15
- EZH_PIO7
- EZH_PIO9
- P1-13/ENET_RXDV
- (near U1) P0
- (near U1) P3
- EZH_CAM-HSYNC
- EZH_CAM-VSYNC
- (near U1) P1
- (near U1) P4
- (near U1) P2
- (near U1) P5
- Part Number
- Description
- PCB Mixdown
- Date
- CCA Mixdown
- Engineer
- Page
- of

## Library data of the parts
C1 C4 C10 C13 C18 = GCM155C71A105KE38D: CAP CER 1UF 10V X7S 0402; Manufacturer: Murata Electronics; Tolerance: ±10%; Substitution Notes: 1µF , 10V , ±10% , X7S , -55°C ~ 125°C , AEC-Q200 , 0402; Value: 1µF; Temperature Coefficient: X7S; Manufacturer Part Number: GCM155C71A105KE38D; ComponentLink1Description: Datasheet (Internal); ComponentLink1URL: https://www.murata.com/~/media/webrenewal/support/library/catalog/products/capacitor/mlcc/c03e.ashx?la=en-us; ComponentLink2Description: Datasheet (External); ComponentLink2URL: https://www.murata.com/~/media/webrenewal/support/library/catalog/products/capacitor/mlcc/c03e.ashx?la=en-us; Supplier 1: Digikey; Supplier Part Number 1: 490-13409-1-ND; Category: Capacitors; Voltage - Rated: 10V; Operating Temperature: -55°C ~ 125°C; Ratings: AEC-Q200; Package: 0402; Thickness (Max): 0.55MM
C2 C3 C5 C6 C8 C9 C11 C12 C14-C17 C19-C21 C23 C26 C27 = GCM155R71A104KA55D: CAP CER 0.1UF 10V X7R 0402; Manufacturer: Murata Electronics; Tolerance: ±10%; Substitution Notes: 0.1µF , 10V , ±10% , X7R , -55°C ~ 125°C , AEC-Q200 , 0402; Value: 0.1µF; Temperature Coefficient: X7R; Manufacturer Part Number: GCM155R71A104KA55D; ComponentLink1Description: Datasheet (Internal); ComponentLink1URL: https://search.murata.co.jp/Ceramy/image/img/A01X/G101/ENG/GCM155R71A104KA55-01.pdf; ComponentLink2Description: Datasheet (External); ComponentLink2URL: https://search.murata.co.jp/Ceramy/image/img/A01X/G101/ENG/GCM155R71A104KA55-01.pdf; Supplier 1: Digikey; Supplier Part Number 1: 490-16434-1-ND; Category: Capacitors; Voltage - Rated: 10V; Operating Temperature: -55°C ~ 125°C; Ratings: AEC-Q200; Package: 0402; Thickness (Max): 0.55MM
C22 C25 = GCJ188C70J475KE02D: CAP CER 4.7UF 6.3V X7S 0603; Manufacturer: Murata Electronics; Tolerance: ±10%; Substitution Notes: 4.7µF , 6.3V , ±10% , X7S , -55°C ~ 125°C , AEC-Q200 , 0603; Value: 4.7µF; Temperature Coefficient: X7S; Manufacturer Part Number: GCJ188C70J475KE02D; ComponentLink1Description: Datasheet (Internal); ComponentLink1URL: https://search.murata.co.jp/Ceramy/image/img/A01X/G101/ENG/GCJ188C70J475KE02-01.pdf; ComponentLink2Description: Datasheet (External); ComponentLink2URL: https://search.murata.co.jp/Ceramy/image/img/A01X/G101/ENG/GCJ188C70J475KE02-01.pdf; Supplier 1: Digikey; Supplier Part Number 1: 490-16480-1-ND; Category: Capacitors; Voltage - Rated: 6.3V; Operating Temperature: -55°C ~ 125°C; Ratings: AEC-Q200; Package: 0603; Thickness (Max): 1.00MM
C24 = GRT188R61A106ME13D: CAP CER 10UF 10V X5R 0603; Manufacturer: Murata Electronics; Tolerance: ±20%; Substitution Notes: 10µF , 10V , ±20% , X5R , -55°C ~ 85°C , AEC-Q200 , 0603; Value: 10µF; Temperature Coefficient: X5R; Manufacturer Part Number: GRT188R61A106ME13D; ComponentLink1Description: Datasheet (Internal); ComponentLink1URL: https://search.murata.co.jp/Ceramy/image/img/A01X/G101/ENG/GRT188R61A106ME13-01.pdf; ComponentLink2Description: Datasheet (External); ComponentLink2URL: https://search.murata.co.jp/Ceramy/image/img/A01X/G101/ENG/GRT188R61A106ME13-01.pdf; Supplier 1: Digikey; Supplier Part Number 1: 490-12312-1-ND; Category: Capacitors; Voltage - Rated: 10V; Operating Temperature: -55°C ~ 85°C; Ratings: AEC-Q200; Package: 0603; Thickness (Max): 0.90MM
C28 C29 = GCM1555C1H120JA16D: CAP CER 12PF 50V C0G/NP0 0402; Manufacturer: Murata Electronics; Temperature Coefficient: C0G, NP0; Tolerance: ±5%; Substitution Notes: 12pF , 50V , ±5% , C0G, NP0 , -55°C ~ 125°C , AEC-Q200 , 0402; Value: 12pF; Manufacturer Part Number: GCM1555C1H120JA16D; ComponentLink1Description: Datasheet (Internal); ComponentLink1URL: https://www.murata.com/~/media/webrenewal/support/library/catalog/products/capacitor/mlcc/c03e.ashx?la=en-us; ComponentLink2Description: Datasheet (External); ComponentLink2URL: https://www.murata.com/~/media/webrenewal/support/library/catalog/products/capacitor/mlcc/c03e.ashx?la=en-us; Supplier 1: Digikey; Supplier Part Number 1: 490-12649-1-ND; Category: Capacitors; Voltage - Rated: 50V; Operating Temperature: -55°C ~ 125°C; Ratings: AEC-Q200; Package: 0402; Thickness (Max): 0.55MM
C30 C31 = GCQ1555C1H9R5BB01D: CAP CER 9.5PF 50V C0G/NP0 0402; Manufacturer: Murata Electronics; Temperature Coefficient: C0G, NP0; Tolerance: ±0.1pF; Substitution Notes: 9.5pF , 50V , ±0.1pF , C0G, NP0 , -55°C ~ 125°C , AEC-Q200 , 0402; Value: 9.5pF; Manufacturer Part Number: GCQ1555C1H9R5BB01D; ComponentLink1Description: Datasheet (Internal); ComponentLink1URL: https://search.murata.co.jp/Ceramy/image/img/A01X/G101/ENG/GCQ1555C1H9R5BB01-01.pdf; ComponentLink2Description: Datasheet (External); ComponentLink2URL: https://search.murata.co.jp/Ceramy/image/img/A01X/G101/ENG/GCQ1555C1H9R5BB01-01.pdf; Supplier 1: Digikey; Supplier Part Number 1: 490-17528-1-ND; Category: Capacitors; Voltage - Rated: 50V; Operating Temperature: -55°C ~ 125°C; Ratings: AEC-Q200; Package: 0402; Thickness (Max): 0.55MM
D1 = APT1608CGCK: LED 1.6X0.8MM 570NM GRN CLR SMD; Manufacturer: Kingbright Corp; Wavelength - Peak: 574nm; Millicandela Rating: 50mcd; Voltage - Forward (Vf) Typ: 2.1V; Viewing Angle: 120°; Color: Green; Current - Test: 20mA; Lens Type: Clear; Lens Style/Size: Rectangle with Flat Top, 1.2mm x 0.8mm; Value: APT1608CGCK; Manufacturer Part Number: APT1608CGCK; RoHS: RoHS Compliant; Wavelength - Dominant: 570nm; Size / Dimension: 1.60mm L x 0.80mm W; Package / Case: 0603 (1608 Metric); Mounting Type: Surface Mount; Packaging: Tape & Reel (TR); Supplier 1: Digi-Key; Supplier Part Number 1: 754-1116-1-ND; Category: Optoelectronics; Stock 1: 89450; Pricing 1: 1=0.2, 10=0.153, 25=0.1224, 100=0.1105, 250=0.102, 500=0.0918 (USD); Height: 0.75mm; Luminous Flux @ Current - Test: -; ComponentLink1URL: http://www.us.kingbright.com/images/catalog/SPEC/APT1608CGCK.pdf; ComponentLink1Description: http://www.us.kingbright.com/images/catalog/SPEC/APT1608CGCK.pdf; Supplier 2: Digikey; Supplier Part Number 2: 160-2162-1-ND
D2 = BAT760-7: DIODE SCHOTTKY 30V 1A SOD323; Manufacturer: Diodes Inc; CategorySort: 400; Voltage - Forward (Vf) (Max) @ If: 550mV @ 1A; Speed: Fast Recovery =< 500ns- > 200mA (Io); Current - Reverse Leakage @ Vr: 50µA @ 15V; Capacitance @ Vr- F: 25pF @ 5V- 1MHz; Num Pins: 2; Diode Suffix: 1A_2C; Category: Diodes; Value: BAT760-7; Manufacturer Part Number: BAT760-7; ComponentLink1Description: Internal Datasheet; ComponentLink1URL: http://www.diodes.com/datasheets/ds30498.pdf; ComponentLink2Description: External Datasheet; ComponentLink2URL: http://www.diodes.com/datasheets/ds30498.pdf; Supplier 1: Digi-Key; Supplier Part Number 1: BAT760DICT-ND; SortValue: BAT760-7; Diode Type: Schottky; Voltage - DC Reverse (Vr) (Max): 30V; Current - Average Rectified (Io): 1A; Reverse Recovery Time (trr): -; Mounting Type: Surface Mount; Package: SC-76- SOD-323; Supplier Device Package: SOD-323; Packaging: Cut Tape (CT)
F1-F4 = Fiducial: Value: PCB Fiducial
J1 = MICROMOD-2222: Micromod Edge Connector - M.2 2222 E Key; Value: Micromod 2222 Card Edge Fingers
L1 = ACML-0402HC-221-T: Ind Chip Bead Multi-Layer 220Ohm 25% 100MHz Ferrite 1A 0402 T/R; Manufacturer: Abracon; Number of Lines: 1; DC Resistance (DCR): 250mR; Shielding: Unshielded; Impedance: 220R; Supplier 1: Mouser; Supplier Part Number 1: 815-ACML-0402HC-221T; Manufacturer Part Number: ACML-0402HC-221-T; RoHS: Yes; Category: Ferrite Beads and Chips; Stock 1: 3420; Packaging: Tape and Reel; ComponentLink1URL: https://datasheet.ciiva.com/41798/acml-0402hc-41798311.pdf?src-supplier=Digikey; ComponentLink1Description: https://datasheet.ciiva.com/41798/acml-0402hc-41798311.pdf?src-supplier=Digikey; Value: ACML-0402HC-221-T; Pricing: 1=0.1, 10=0.032, 50=0.032, 100=0.023, 1000=0.015, 10000=0.015 (USD); Mounting Technology: Surface Mount; Case/Package: 0402; Case Code (Metric): 1005; Case Code (Imperial): 0402; Weight: 2.3E-05oz; Min Operating Temperature: -55°C; Max Operating Temperature: 125°C; Package Quantity: 1; Current Rating: 1A; Max Current Rating: 1A; Termination: SMD/SMT; Max DC Current: 1A; Tolerance: 25%; Number of Channels: 1; Test Frequency: 100MHz; Series: ACML-HC; Length: 0.039inch; Width: 0.02inch; Height: 0.026inch; RoHS Compliant: Yes
L2 = NRH3012T2R2MN: Inductor 2.2µH 1.5A; Manufacturer: Taiyo Yuden; CategorySort: 300; Inductance (uH): 2.2; Tolerance: ±20%; DCR Max (Ohms): 90 mOhm Max; SRF typ (MHz): 78MHz; Isat (A): 1.5; IRMS: 1.37; Shielding: Sheilded; Category: Inductors; Value: 2.2µH 1.5A; Manufacturer Part Number: NRH3012T2R2MN; ComponentLink1Description: External Datasheet; ComponentLink1URL: https://www.yuden.co.jp/productdata/catalog/en/wound04_e.pdf; Sort Value: 2.2_1.5; Sort Value Package: 2.2_1.5_NRH3012; Part Number: NRH3012T2R2MN; Supplier 1: Digikey; Supplier Part Number 1: 587-2589-1-ND; Supplier Unit Price 1: 0.28; Package: NRH3012; Height (mm): 1.2MM; Rating: -
PCB1 = PCB-10004-D: PCB-10004 Mixdown D; Manufacturer: Wavenumber; Value: PCB-10004-D; Manufacturer Part Number: PCB-10004-D; MIxdown: D
R1 = ERJ-3EKF1001V: RES 1K OHM 1/10W 1% 0603 SMD; Manufacturer: Panasonic Electronic Components; Package Power: 0603  (0.1W); Power (Watts): 0.1W- 1/10W; Temperature Coefficient: ±100ppm/°C; Limiting Element Voltage: 75; Maximum Overload Voltage: 150; Maximum Working Voltage: 10.0V; Substitution Notes: 1k , ±1% , 0603 , AEC-Q200; Value: 1k; Manufacturer Part Number: ERJ-3EKF1001V; ComponentLink1Description: Internal Datasheet; ComponentLink1URL: datasheets\Panasonic Electronic Components\AOA0000CE2.pdf; ComponentLink2Description: External Datasheet; ComponentLink2URL: http://industrial.panasonic.com/www-data/pdf/AOA0000/AOA0000CE2.pdf; Supplier 1: Digi-Key; Supplier Part Number 1: P1.00KHCT-ND; Category: Resistors; Resistance (Ohms): 1k; Composition: Thick Film; Features: -; Tolerance: ±1%; Package: 0603 (1608 Metric); Supplier Package: 0603; Size / Dimension: 0.063" L x 0.031" W (1.60mm x 0.80mm); Height: 0.55MM; Number of Terminations: 2; Packaging: Cut Tape (CT); Sort Value: 1000; Sort Value Package: 603_1000; Ratings: AEC-Q200
R2 R3 R7 R9 = ERJ-3EKF1002V: RES 10K OHM 1/10W 1% 0603 SMD; Manufacturer: Panasonic Electronic Components; Package Power: 0603  (0.1W); Power (Watts): 0.1W- 1/10W; Temperature Coefficient: ±100ppm/°C; Limiting Element Voltage: 75; Maximum Overload Voltage: 150; Maximum Working Voltage: 31.6V; Substitution Notes: 10k , ±1% , 0603 , AEC-Q200; Value: 10k; Manufacturer Part Number: ERJ-3EKF1002V; ComponentLink1Description: Internal Datasheet; ComponentLink1URL: datasheets\Panasonic Electronic Components\AOA0000CE2.pdf; ComponentLink2Description: External Datasheet; ComponentLink2URL: http://industrial.panasonic.com/www-data/pdf/AOA0000/AOA0000CE2.pdf; Supplier 1: Digi-Key; Supplier Part Number 1: P10.0KHCT-ND; Category: Resistors; Resistance (Ohms): 10k; Composition: Thick Film; Features: -; Tolerance: ±1%; Package: 0603 (1608 Metric); Supplier Package: 0603; Size / Dimension: 0.063" L x 0.031" W (1.60mm x 0.80mm); Height: 0.55MM; Number of Terminations: 2; Packaging: Cut Tape (CT); Sort Value: 10000; Sort Value Package: 603_10000; Ratings: AEC-Q200
R4 R5 = ERJ-3EKF33R0V: RES 33 OHM 1/10W 1% 0603 SMD; Manufacturer: Panasonic Electronic Components; Package Power: 0603  (0.1W); Power (Watts): 0.1W- 1/10W; Temperature Coefficient: ±100ppm/°C; Limiting Element Voltage: 75; Maximum Overload Voltage: 150; Maximum Working Voltage: 1.8V; Substitution Notes: 33 , ±1% , 0603 , AEC-Q200; Value: 33; Manufacturer Part Number: ERJ-3EKF33R0V; ComponentLink1Description: Internal Datasheet; ComponentLink1URL: datasheets\Panasonic Electronic Components\AOA0000CE2.pdf; ComponentLink2Description: External Datasheet; ComponentLink2URL: http://industrial.panasonic.com/www-data/pdf/AOA0000/AOA0000CE2.pdf; Supplier 1: Digi-Key; Supplier Part Number 1: P33.0HCT-ND; Category: Resistors; Resistance (Ohms): 33; Composition: Thick Film; Features: -; Tolerance: ±1%; Package: 0603 (1608 Metric); Supplier Package: 0603; Size / Dimension: 0.063" L x 0.031" W (1.60mm x 0.80mm); Height: 0.55MM; Number of Terminations: 2; Packaging: Cut Tape (CT); Sort Value: 33; Sort Value Package: 603_33; Ratings: AEC-Q200
R6 = ERJ-2GE0R00X: RES 0.0 OHM 1/10W JUMP 0402 SMD; Manufacturer: Panasonic Electronic Components; Package Power: 0402  (0.1W); Power (Watts): 0.1W- 1/10W; Tolerance: Jumper; Limiting Element Voltage: 50; Maximum Overload Voltage: 100; Maximum Working Voltage: 0.0V; Substitution Notes: 0 , Jumper , 0402 , AEC-Q200; Value: 0; Manufacturer Part Number: ERJ-2GE0R00X; ComponentLink1Description: Internal Datasheet; ComponentLink1URL: datasheets\Panasonic Electronic Components\AOA0000CE1.pdf; ComponentLink2Description: External Datasheet; ComponentLink2URL: http://industrial.panasonic.com/www-data/pdf/AOA0000/AOA0000CE1.pdf; Supplier 1: Digi-Key; Supplier Part Number 1: P0.0JCT-ND; Category: Resistors; Resistance (Ohms): 0; Composition: Thick Film; Features: -; Temperature Coefficient: -; Package: 0402 (1005 Metric); Supplier Package: 0402; Size / Dimension: 0.039" L x 0.020" W (1.00mm x 0.50mm); Height: 0.40MM; Number of Terminations: 2; Sort Value: 0; Sort Value Package: 402_0; Ratings: AEC-Q200
R8 = ERJ-3EKF2002V: RES 20K OHM 1/10W 1% 0603 SMD; Manufacturer: Panasonic Electronic Components; Package Power: 0603  (0.1W); Power (Watts): 0.1W- 1/10W; Temperature Coefficient: ±100ppm/°C; Limiting Element Voltage: 75; Maximum Overload Voltage: 150; Maximum Working Voltage: 44.7V; Substitution Notes: 20k , ±1% , 0603 , AEC-Q200; Value: 20k; Manufacturer Part Number: ERJ-3EKF2002V; ComponentLink1Description: Internal Datasheet; ComponentLink1URL: datasheets\Panasonic Electronic Components\AOA0000CE2.pdf; ComponentLink2Description: External Datasheet; ComponentLink2URL: http://industrial.panasonic.com/www-data/pdf/AOA0000/AOA0000CE2.pdf; Supplier 1: Digi-Key; Supplier Part Number 1: P20.0KHCT-ND; Category: Resistors; Resistance (Ohms): 20k; Composition: Thick Film; Features: -; Tolerance: ±1%; Package: 0603 (1608 Metric); Supplier Package: 0603; Size / Dimension: 0.063" L x 0.031" W (1.60mm x 0.80mm); Height: 0.55MM; Number of Terminations: 2; Packaging: Cut Tape (CT); Sort Value: 20000; Sort Value Package: 603_20000; Ratings: AEC-Q200
U1 = NX32N348VDFT_B: IC MCX N94 150MHZ DUAL CORE NPU; Manufacturer: NXP SEMICONDUCTOR; SPLIT_INST: TRUE; PCB Footprint: bga184_0p5_9x9_sm; Temp Range: -40  ¡ãC to +105 ¡ãC; PRE_APN: 344-02549; CAD_APPROVED: Yes; AGILE_PN: TMP-CIP-10342; CLASS: IC; 3D_Mechanical_Footprint_File: http://fcl.am.freescale.net/ALLEGRO/step/bga184_0p5_9x9_sm.STEP; Manufacturer Part Number: MCXN947VDFT; ROHS: Yes; HEIGHT: 0.98 MM; Package Size: 9x9; Package Type: SMD/SMT; Parameter 1: *
U2 = APS6408L-3OBM-BA: 3.3v Double-Data-Rate Octal SPI Xccela PSRAM; Manufacturer: AP Memory; Manufacturer Part Number: APS6408L-3OBM-BA; Availability: In Stock; Mouser_Link: https://eu.mouser.com/ProductDetail/AP-Memory/APS6408L-OBM-BA?qs=IS%252B4QmGtzzq1j2ngF%2F6ZwQ%3D%3D; Check_prices: https://eu.mouser.com/ProductDetail/AP-Memory/APS6408L-OBM-BA?qs=IS%252B4QmGtzzq1j2ngF%2F6ZwQ%3D%3D; Purchase-URL: https://eu.mouser.com/ProductDetail/AP-Memory/APS6408L-OBM-BA?qs=IS%252B4QmGtzzq1j2ngF%2F6ZwQ%3D%3D; Package: BGA-24; Price: 2,09 €; Value: APS6408L-3OBM-BA
X1 = NX3215SA-32.768K-STD-MUA-9: CRYSTAL 32.768KHZ 9PF SMD; Manufacturer: NDK; Frequency Tolerance: 20ppm; ESR (Equivalent Series Resistance): 70kR; Value: 32.768kHz; Supplier 1: Digi-Key; Supplier Part Number 1: 644-1155-6-ND; Manufacturer Part Number: NX3215SA-32.768K-STD-MUA-9; Stock 1: 39338; Pricing 1: 1=0.68, 10=0.602, 50=0.5628, 100=0.4974, 500=0.47124, 1000=0.3927 (USD); Mount: Surface Mount; Case/Package: SMD/SMT; Number of Pins: 2; Min Operating Temperature: -40°C; Max Operating Temperature: 85°C; Frequency: 32.768kHz; Package Quantity: 1000; Load Capacitance: 9pF; Packaging: Tape and Reel; Length: 0.126inch; Height: 0.035inch; Width: 0.059inch; Lead Free: Lead Free
Y1 = ECS-240-12-37B-CKY-TR: Crystal 24MHz ±10ppm (Tol) ±10ppm (Stability) 12pF FUND 50Ohm 4-Pin Mini-CSMD T/R; Manufacturer: ECS Inc.; Manufacturer Part Number: ECS-240-12-37B-CKY-TR; Value: 24MHz; Supplier 1: Digi-Key; Supplier Part Number 1: XC3064CT-ND; RoHS: No; Stock 1: 439340; Pricing: 1=0.38, 10=0.313, 50=0.282, 100=0.2507, 500=0.23818 (USD); ComponentLink1URL: https://www.ecsxtal.com/store/pdf/ECX-1637B.pdf?src-supplier=Digi-Key; ComponentLink1Description: https://www.ecsxtal.com/store/pdf/ECX-1637B.pdf?src-supplier=Digi-Key; Parameter 1: *
TP1-TP10 = SMT_TEST: Value: SMT_TEST